# Altium schematic sheet Shematic.SchDoc: Shematic RF
size A4 portrait; Organization: Altium Limited; Address1: L3, 12a Rodborough Rd; Address2: Frenchs Forest; Address3: NSW; Address4: Australia 2086
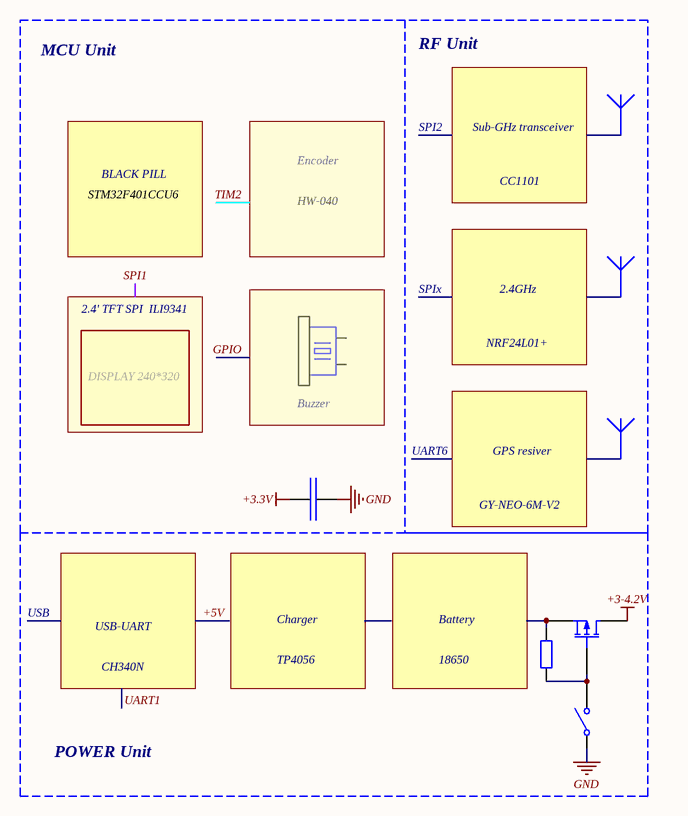
[diagram p0: Shematic.SchDoc]

## Parts
?  4.7K  [AXIAL-0.4]  (value not drawn)
BUZ?  Buzzer
C?  10uF  [CAPC1608X90]  (value not drawn)
Q?  MOSFET-P  [E3]  (value not drawn)
S?  POWER EN.  [SPST-2]  (value not drawn)

## Blocks framed on the sheet
POWER Unit: ? Q? S?

## Nets
+3-4.2V: Q?.1(D)
+3.3V: C?.2
GND: C?.1 S?.1(COMMON)
Net?_1: ?.1 Q?.2(G) S?.2(NO)
Net?_2: ?.2 Q?.3(S)

Not connected (* = marked no-connect by the designer): BUZ? 1(19) 2

## Notes on the sheet
- RF Unit
- MCU Unit
- BLACK PILL
- Encoder
- SPI2
- Sub-GHz transceiver
- CC1101
- STM32F401CCU6
- HW-040
- 2.4' TFT SPI  ILI9341
- SPIx
- 2.4GHz
- DISPLAY 240*320
- NRF24L01+
- UART6
- GPS resiver
- GY-NEO-6M-V2
- USB
- USB-UART
- +5V
- Charger
- Battery
- CH340N
- TP4056
- 18650
- Labels drawn without touching a wire or pin: SPI1, UART1
- Title
- Size:
- Date:
- A4
- Number:
- Time:
- Revision:
- Sheet
- of
- File:

## Library data of the parts
? = Res2: Resistor; Published: 8-Jun-2000; LatestRevisionDate: 17-Jul-2002; LatestRevisionNote: Re-released for DXP Platform.; PackageReference: AXIAL-0.4; Publisher: Altium Limited; PackageDescription: Axial Device, Thru-Hole; 2 Leads; 0.4 in Pin Spacing
C? = CC0603MRX5R8BB106: Керамический ЧИП-конденсатор 0603 X5R 10мкФ ±20% 25В
Q? = MOSFET-P: P-Channel MOSFET; Published: 8-Jun-2000; LatestRevisionDate: 17-Jul-2002; LatestRevisionNote: Re-released for DXP Platform.; PackageVersion: 1995/1996; PackageReference: E3; Publisher: Altium Limited; PackageDescription: TO, Flat Index; 3 In-Line, Axial Leads; Body Dia. 4.6mm; Lead Dia. 0.5 mm (max)
S? = SW-SPST: Single-Pole, Single-Throw Switch; Published: 24-Mar-1999; LatestRevisionDate: 17-Jul-2002; LatestRevisionNote: Re-released for DXP Platform.; PackageReference: SPST-2; Publisher: Altium Limited; PackageDescription: Switch; 2 Leads